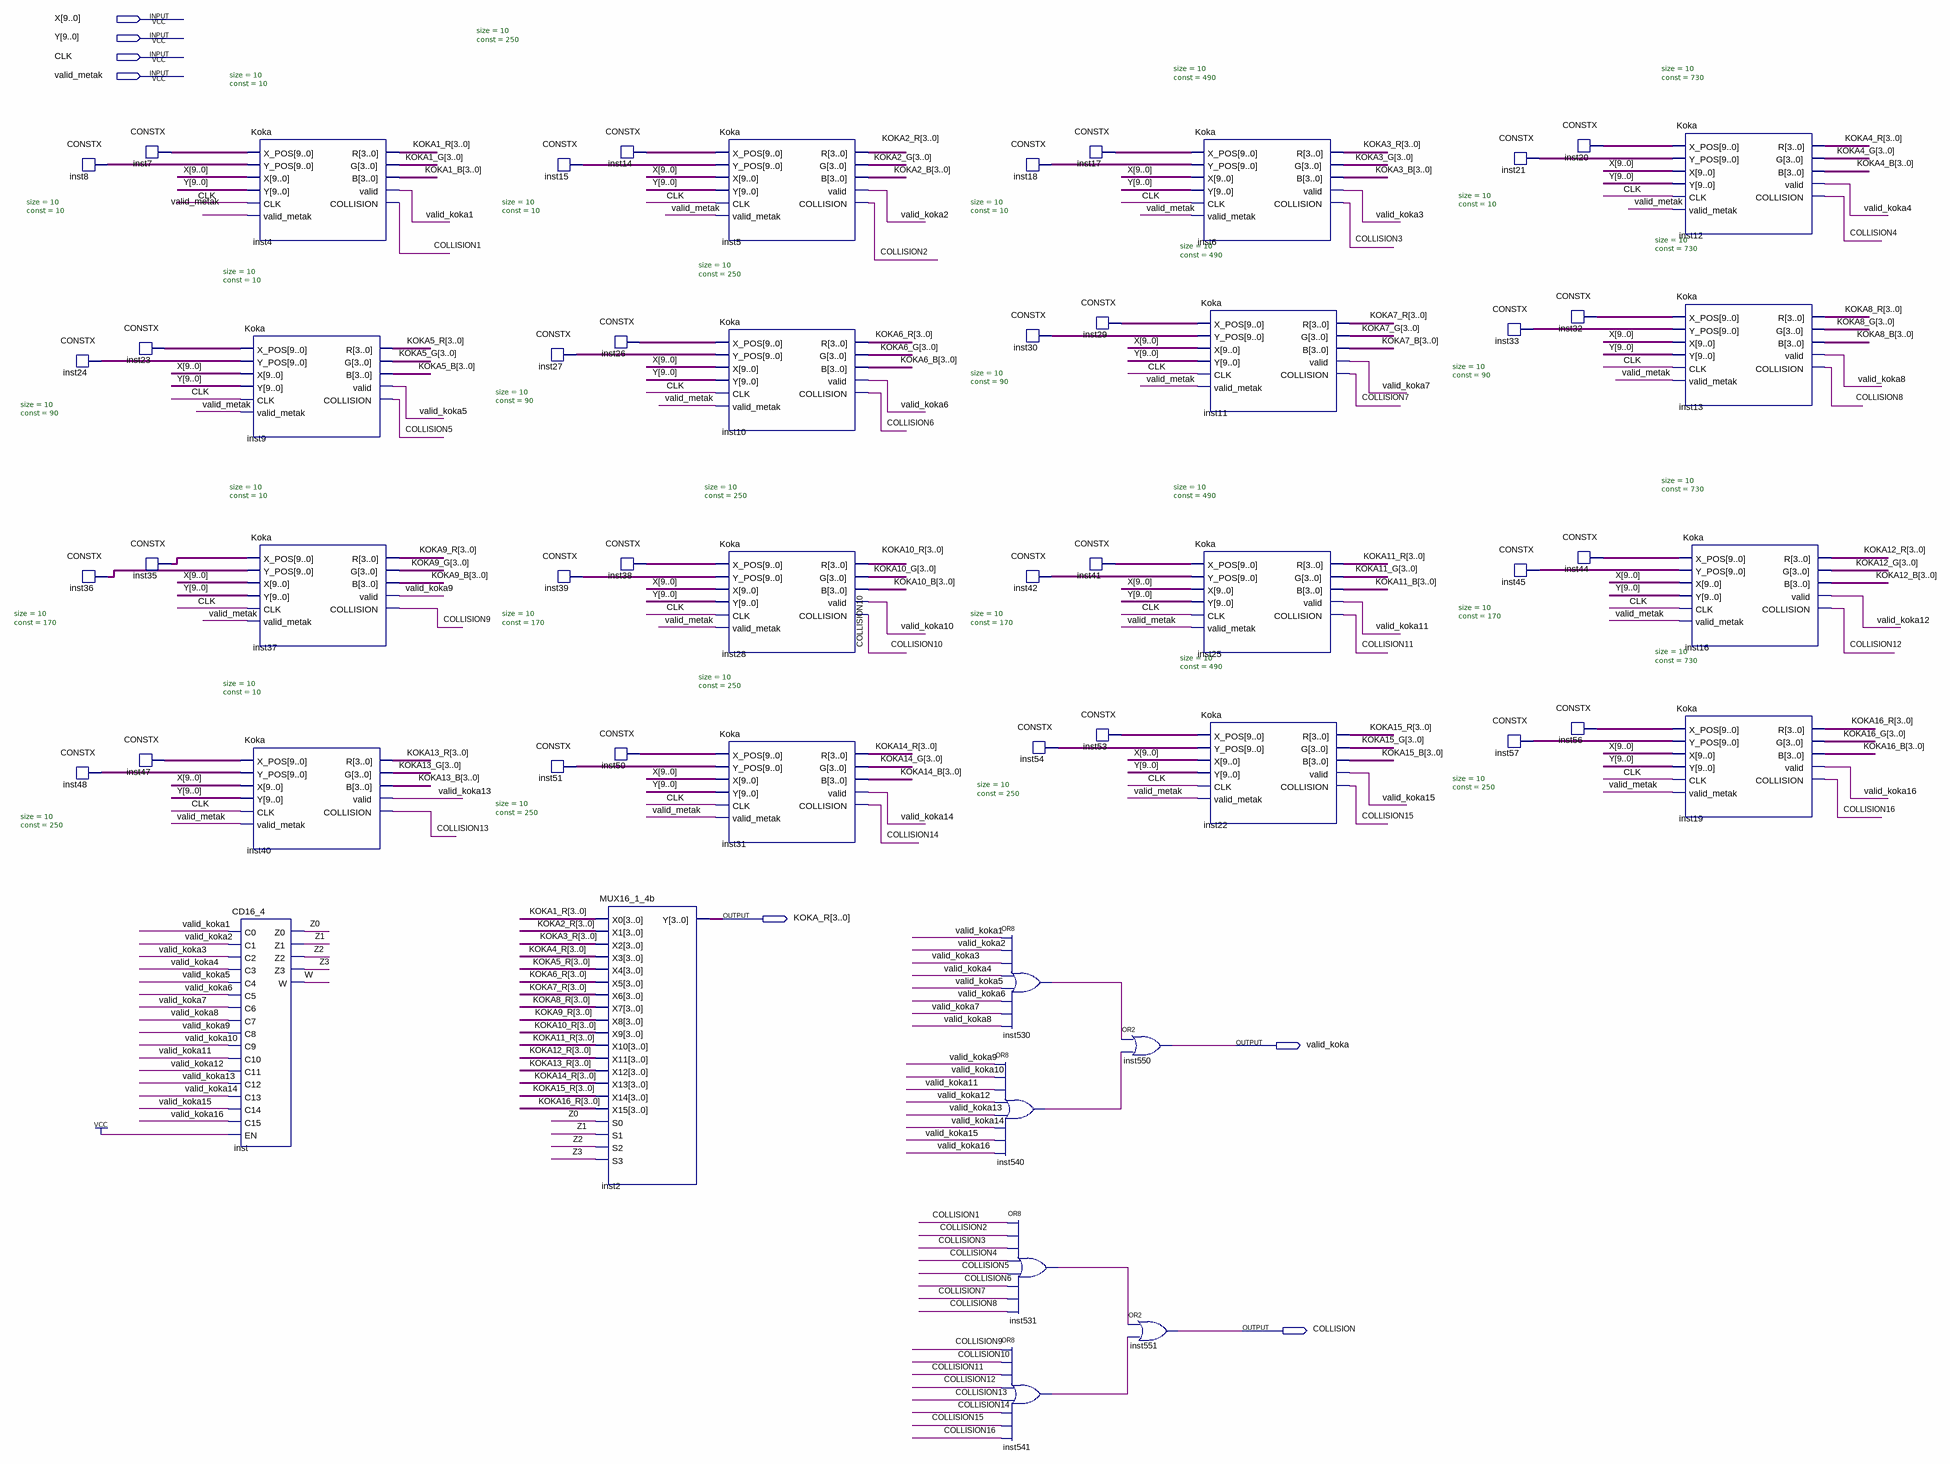
[diagram p0: schematic sheet]
// Quartus schematic FarmaKoka.bdf as structural Verilog: 56 symbols, 7 pins
module FarmaKoka (
  input  [9:0] X,
  input  [9:0] Y,
  input  CLK,
  input  valid_metak,
  output [3:0] KOKA_R,
  output valid_koka,
  output COLLISION
);

  wire COLLISION1, COLLISION2, COLLISION3, COLLISION4, COLLISION5, COLLISION6, COLLISION7, COLLISION8,
       COLLISION9, COLLISION10, COLLISION11, COLLISION12, COLLISION13, COLLISION14, COLLISION15, COLLISION16,
       inst530_out, inst531_out, inst540_out, inst541_out, valid_koka1, valid_koka2, valid_koka3,
       valid_koka4, valid_koka5, valid_koka6, valid_koka7, valid_koka8, valid_koka9, valid_koka10,
       valid_koka11, valid_koka12, valid_koka13, valid_koka14, valid_koka15, valid_koka16, W, Z0, Z1, Z2, Z3;
  wire [3:0] KOKA1_B, KOKA1_G, KOKA1_R, KOKA2_B, KOKA2_G, KOKA2_R, KOKA3_B, KOKA3_G, KOKA3_R, KOKA4_B,
       KOKA4_G, KOKA4_R, KOKA5_B, KOKA5_G, KOKA5_R, KOKA6_B, KOKA6_G, KOKA6_R, KOKA7_B, KOKA7_G, KOKA7_R,
       KOKA8_B, KOKA8_G, KOKA8_R, KOKA9_B, KOKA9_G, KOKA9_R, KOKA10_B, KOKA10_G, KOKA10_R, KOKA11_B,
       KOKA11_G, KOKA11_R, KOKA12_B, KOKA12_G, KOKA12_R, KOKA13_B, KOKA13_G, KOKA13_R, KOKA14_B, KOKA14_G,
       KOKA14_R, KOKA15_B, KOKA15_G, KOKA15_R, KOKA16_B, KOKA16_G, KOKA16_R;
  wire [9:0] inst7_data, inst8_data, inst14_data, inst15_data, inst17_data, inst18_data, inst20_data,
       inst21_data, inst23_data, inst24_data, inst26_data, inst27_data, inst29_data, inst30_data,
       inst32_data, inst33_data, inst35_data, inst36_data, inst38_data, inst39_data, inst41_data,
       inst42_data, inst44_data, inst45_data, inst47_data, inst48_data, inst50_data, inst51_data,
       inst53_data, inst54_data, inst56_data, inst57_data;

  CONSTX #(.size(10), .\const (10)) inst8 (.data(inst8_data));
  CONSTX #(.size(10), .\const (90)) inst24 (.data(inst24_data));
  CONSTX #(.size(10), .\const (170)) inst36 (.data(inst36_data));
  CONSTX #(.size(10), .\const (250)) inst48 (.data(inst48_data));
  CONSTX #(.size(10), .\const (10)) inst7 (.data(inst7_data));
  CONSTX #(.size(10), .\const (10)) inst23 (.data(inst23_data));
  CONSTX #(.size(10), .\const (10)) inst35 (.data(inst35_data));
  CONSTX #(.size(10), .\const (10)) inst47 (.data(inst47_data));
  Koka inst4 (
    .X_POS(inst7_data), .Y_POS(inst8_data), .X(X), .Y(Y), .CLK(CLK), .valid_metak(valid_metak), .R(KOKA1_R),
    .G(KOKA1_G), .B(KOKA1_B), .valid(valid_koka1), .COLLISION(COLLISION1));
  Koka inst9 (
    .X_POS(inst23_data), .Y_POS(inst24_data), .X(X), .Y(Y), .CLK(CLK), .valid_metak(valid_metak),
    .R(KOKA5_R), .G(KOKA5_G), .B(KOKA5_B), .valid(valid_koka5), .COLLISION(COLLISION5));
  Koka inst37 (
    .X_POS(inst35_data), .Y_POS(inst36_data), .X(X), .Y(Y), .CLK(CLK), .valid_metak(valid_metak),
    .R(KOKA9_R), .G(KOKA9_G), .B(KOKA9_B), .valid(valid_koka9), .COLLISION(COLLISION9));
  Koka inst40 (
    .X_POS(inst47_data), .Y_POS(inst48_data), .X(X), .Y(Y), .CLK(CLK), .valid_metak(valid_metak),
    .R(KOKA13_R), .G(KOKA13_G), .B(KOKA13_B), .valid(valid_koka13), .COLLISION(COLLISION13));
  CD16_4 inst (
    .C0(valid_koka1), .C1(valid_koka2), .C2(valid_koka3), .C3(valid_koka4), .C4(valid_koka5),
    .C5(valid_koka6), .C6(valid_koka7), .C7(valid_koka8), .C8(valid_koka9), .C9(valid_koka10),
    .C10(valid_koka11), .C11(valid_koka12), .C12(valid_koka13), .C13(valid_koka14), .C14(valid_koka15),
    .C15(valid_koka16), .EN(1'b1), .Z0(Z0), .Z1(Z1), .Z2(Z2), .Z3(Z3), .W(W));
  CONSTX #(.size(10), .\const (10)) inst15 (.data(inst15_data));
  CONSTX #(.size(10), .\const (90)) inst27 (.data(inst27_data));
  CONSTX #(.size(10), .\const (170)) inst39 (.data(inst39_data));
  CONSTX #(.size(10), .\const (250)) inst51 (.data(inst51_data));
  CONSTX #(.size(10), .\const (250)) inst14 (.data(inst14_data));
  CONSTX #(.size(10), .\const (250)) inst26 (.data(inst26_data));
  CONSTX #(.size(10), .\const (250)) inst38 (.data(inst38_data));
  CONSTX #(.size(10), .\const (250)) inst50 (.data(inst50_data));
  MUX16_1_4b inst2 (
    .X0(KOKA1_R), .X1(KOKA2_R), .X2(KOKA3_R), .X3(KOKA4_R), .X4(KOKA5_R), .X5(KOKA6_R), .X6(KOKA7_R),
    .X7(KOKA8_R), .X8(KOKA9_R), .X9(KOKA10_R), .X10(KOKA11_R), .X11(KOKA12_R), .X12(KOKA13_R),
    .X13(KOKA14_R), .X14(KOKA15_R), .X15(KOKA16_R), .S0(Z0), .S1(Z1), .S2(Z2), .S3(Z3), .Y(KOKA_R));
  Koka inst5 (
    .X_POS(inst14_data), .Y_POS(inst15_data), .X(X), .Y(Y), .CLK(CLK), .valid_metak(valid_metak),
    .R(KOKA2_R), .G(KOKA2_G), .B(KOKA2_B), .valid(valid_koka2), .COLLISION(COLLISION2));
  Koka inst10 (
    .X_POS(inst26_data), .Y_POS(inst27_data), .X(X), .Y(Y), .CLK(CLK), .valid_metak(valid_metak),
    .R(KOKA6_R), .G(KOKA6_G), .B(KOKA6_B), .valid(valid_koka6), .COLLISION(COLLISION6));
  Koka inst28 (
    .X_POS(inst38_data), .Y_POS(inst39_data), .X(X), .Y(Y), .CLK(CLK), .valid_metak(valid_metak),
    .R(KOKA10_R), .G(KOKA10_G), .B(KOKA10_B), .valid(valid_koka10), .COLLISION(COLLISION10));
  Koka inst31 (
    .X_POS(inst50_data), .Y_POS(inst51_data), .X(X), .Y(Y), .CLK(CLK), .valid_metak(valid_metak),
    .R(KOKA14_R), .G(KOKA14_G), .B(KOKA14_B), .valid(valid_koka14), .COLLISION(COLLISION14));
  CONSTX #(.size(10), .\const (10)) inst18 (.data(inst18_data));
  CONSTX #(.size(10), .\const (90)) inst30 (.data(inst30_data));
  CONSTX #(.size(10), .\const (170)) inst42 (.data(inst42_data));
  or inst530 (inst530_out, valid_koka1, valid_koka2, valid_koka3, valid_koka4, valid_koka5, valid_koka6, valid_koka7, valid_koka8);
  or inst540 (inst540_out, valid_koka9, valid_koka10, valid_koka11, valid_koka12, valid_koka13, valid_koka14, valid_koka15, valid_koka16);
  or inst531 (inst531_out, COLLISION1, COLLISION2, COLLISION3, COLLISION4, COLLISION5, COLLISION6, COLLISION7, COLLISION8);
  or inst541 (inst541_out, COLLISION9, COLLISION10, COLLISION11, COLLISION12, COLLISION13, COLLISION14, COLLISION15, COLLISION16);
  CONSTX #(.size(10), .\const (250)) inst54 (.data(inst54_data));
  CONSTX #(.size(10), .\const (490)) inst17 (.data(inst17_data));
  CONSTX #(.size(10), .\const (490)) inst29 (.data(inst29_data));
  CONSTX #(.size(10), .\const (490)) inst41 (.data(inst41_data));
  CONSTX #(.size(10), .\const (490)) inst53 (.data(inst53_data));
  or inst550 (valid_koka, inst530_out, inst540_out);
  or inst551 (COLLISION, inst531_out, inst541_out);
  Koka inst6 (
    .X_POS(inst17_data), .Y_POS(inst18_data), .X(X), .Y(Y), .CLK(CLK), .valid_metak(valid_metak),
    .R(KOKA3_R), .G(KOKA3_G), .B(KOKA3_B), .valid(valid_koka3), .COLLISION(COLLISION3));
  Koka inst11 (
    .X_POS(inst29_data), .Y_POS(inst30_data), .X(X), .Y(Y), .CLK(CLK), .valid_metak(valid_metak),
    .R(KOKA7_R), .G(KOKA7_G), .B(KOKA7_B), .valid(valid_koka7), .COLLISION(COLLISION7));
  Koka inst25 (
    .X_POS(inst41_data), .Y_POS(inst42_data), .X(X), .Y(Y), .CLK(CLK), .valid_metak(valid_metak),
    .R(KOKA11_R), .G(KOKA11_G), .B(KOKA11_B), .valid(valid_koka11), .COLLISION(COLLISION11));
  Koka inst22 (
    .X_POS(inst53_data), .Y_POS(inst54_data), .X(X), .Y(Y), .CLK(CLK), .valid_metak(valid_metak),
    .R(KOKA15_R), .G(KOKA15_G), .B(KOKA15_B), .valid(valid_koka15), .COLLISION(COLLISION15));
  CONSTX #(.size(10), .\const (10)) inst21 (.data(inst21_data));
  CONSTX #(.size(10), .\const (90)) inst33 (.data(inst33_data));
  CONSTX #(.size(10), .\const (170)) inst45 (.data(inst45_data));
  CONSTX #(.size(10), .\const (250)) inst57 (.data(inst57_data));
  CONSTX #(.size(10), .\const (730)) inst20 (.data(inst20_data));
  CONSTX #(.size(10), .\const (730)) inst32 (.data(inst32_data));
  CONSTX #(.size(10), .\const (730)) inst44 (.data(inst44_data));
  CONSTX #(.size(10), .\const (730)) inst56 (.data(inst56_data));
  Koka inst12 (
    .X_POS(inst20_data), .Y_POS(inst21_data), .X(X), .Y(Y), .CLK(CLK), .valid_metak(valid_metak),
    .R(KOKA4_R), .G(KOKA4_G), .B(KOKA4_B), .valid(valid_koka4), .COLLISION(COLLISION4));
  Koka inst13 (
    .X_POS(inst32_data), .Y_POS(inst33_data), .X(X), .Y(Y), .CLK(CLK), .valid_metak(valid_metak),
    .R(KOKA8_R), .G(KOKA8_G), .B(KOKA8_B), .valid(valid_koka8), .COLLISION(COLLISION8));
  Koka inst16 (
    .X_POS(inst44_data), .Y_POS(inst45_data), .X(X), .Y(Y), .CLK(CLK), .valid_metak(valid_metak),
    .R(KOKA12_R), .G(KOKA12_G), .B(KOKA12_B), .valid(valid_koka12), .COLLISION(COLLISION12));
  Koka inst19 (
    .X_POS(inst56_data), .Y_POS(inst57_data), .X(X), .Y(Y), .CLK(CLK), .valid_metak(valid_metak),
    .R(KOKA16_R), .G(KOKA16_G), .B(KOKA16_B), .valid(valid_koka16), .COLLISION(COLLISION16));
endmodule
